# Altium schematic sheet PA1_Alim.SchDoc
size 199 x 149 mm
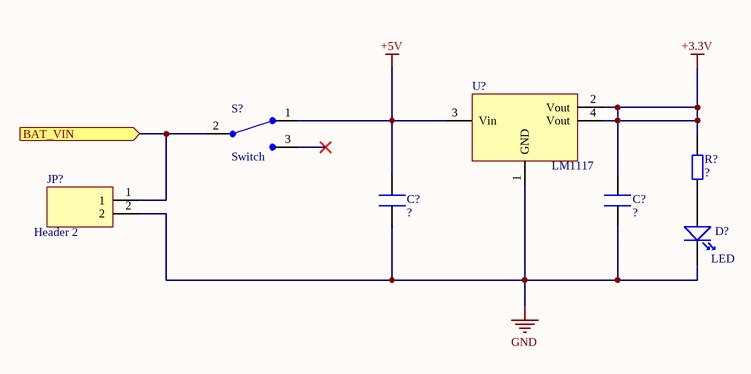
[diagram p0: PA1_Alim.SchDoc]

## Parts
(Parts that share a designator on the sheet are numbered #1, #2 ... from top to bottom, then left to right.)
C?#1  Condo  (value not drawn)  (no BOM)
C?#2  Condo  (value not drawn)  (no BOM)
D?  LED  (no BOM)
JP?  Header 2  (no BOM)
R?  Res  (value not drawn)  (no BOM)
S?  Switch  (no BOM)
U?  LM1117

## Ports
BAT_VIN (in)

## Nets
+3.3V: C?#2.2 R?.2 U?.2(Vout) U?.4(Vout)
+5V: C?#1.2 S?.1(Vout) U?.3(Vin)
GND: C?#1.1 C?#2.1 D?.2(-) JP?.2 U?.1(GND)
BAT_VIN: JP?.1 S?.2(Vin) ; port BAT_VIN
NetD?_1: D?.1(+) R?.1

Not connected (* = marked no-connect by the designer): S? 3(NC)*

## Library data of the parts
C?#1 C?#2 = Condo: Condensateur; Valeur: ?
D? = LED: LED Standard
JP? = Header 2: Header 2 Pins Mâle
R? = Res: Résistance; Valeur: ?
S? = Switch: Switch Standard 3 Pins
U? = LM1117: Régulateur de tension; Fabricant: Texas Instruments; DataSheet: http://www.farnell.com/datasheets/2019100.pdf; RefFabricant: LM1117